# EAGLE design Adapter - Stacking 2 wire [CRY8EI] (EAGLE 9.5.2)
LICENSE: CERN OHL v1.2; REV: CRY8EI; TITLE: SenseTemp 2 Wire Adapter; URL: https://github.com/CapableRobot/SenseTemp
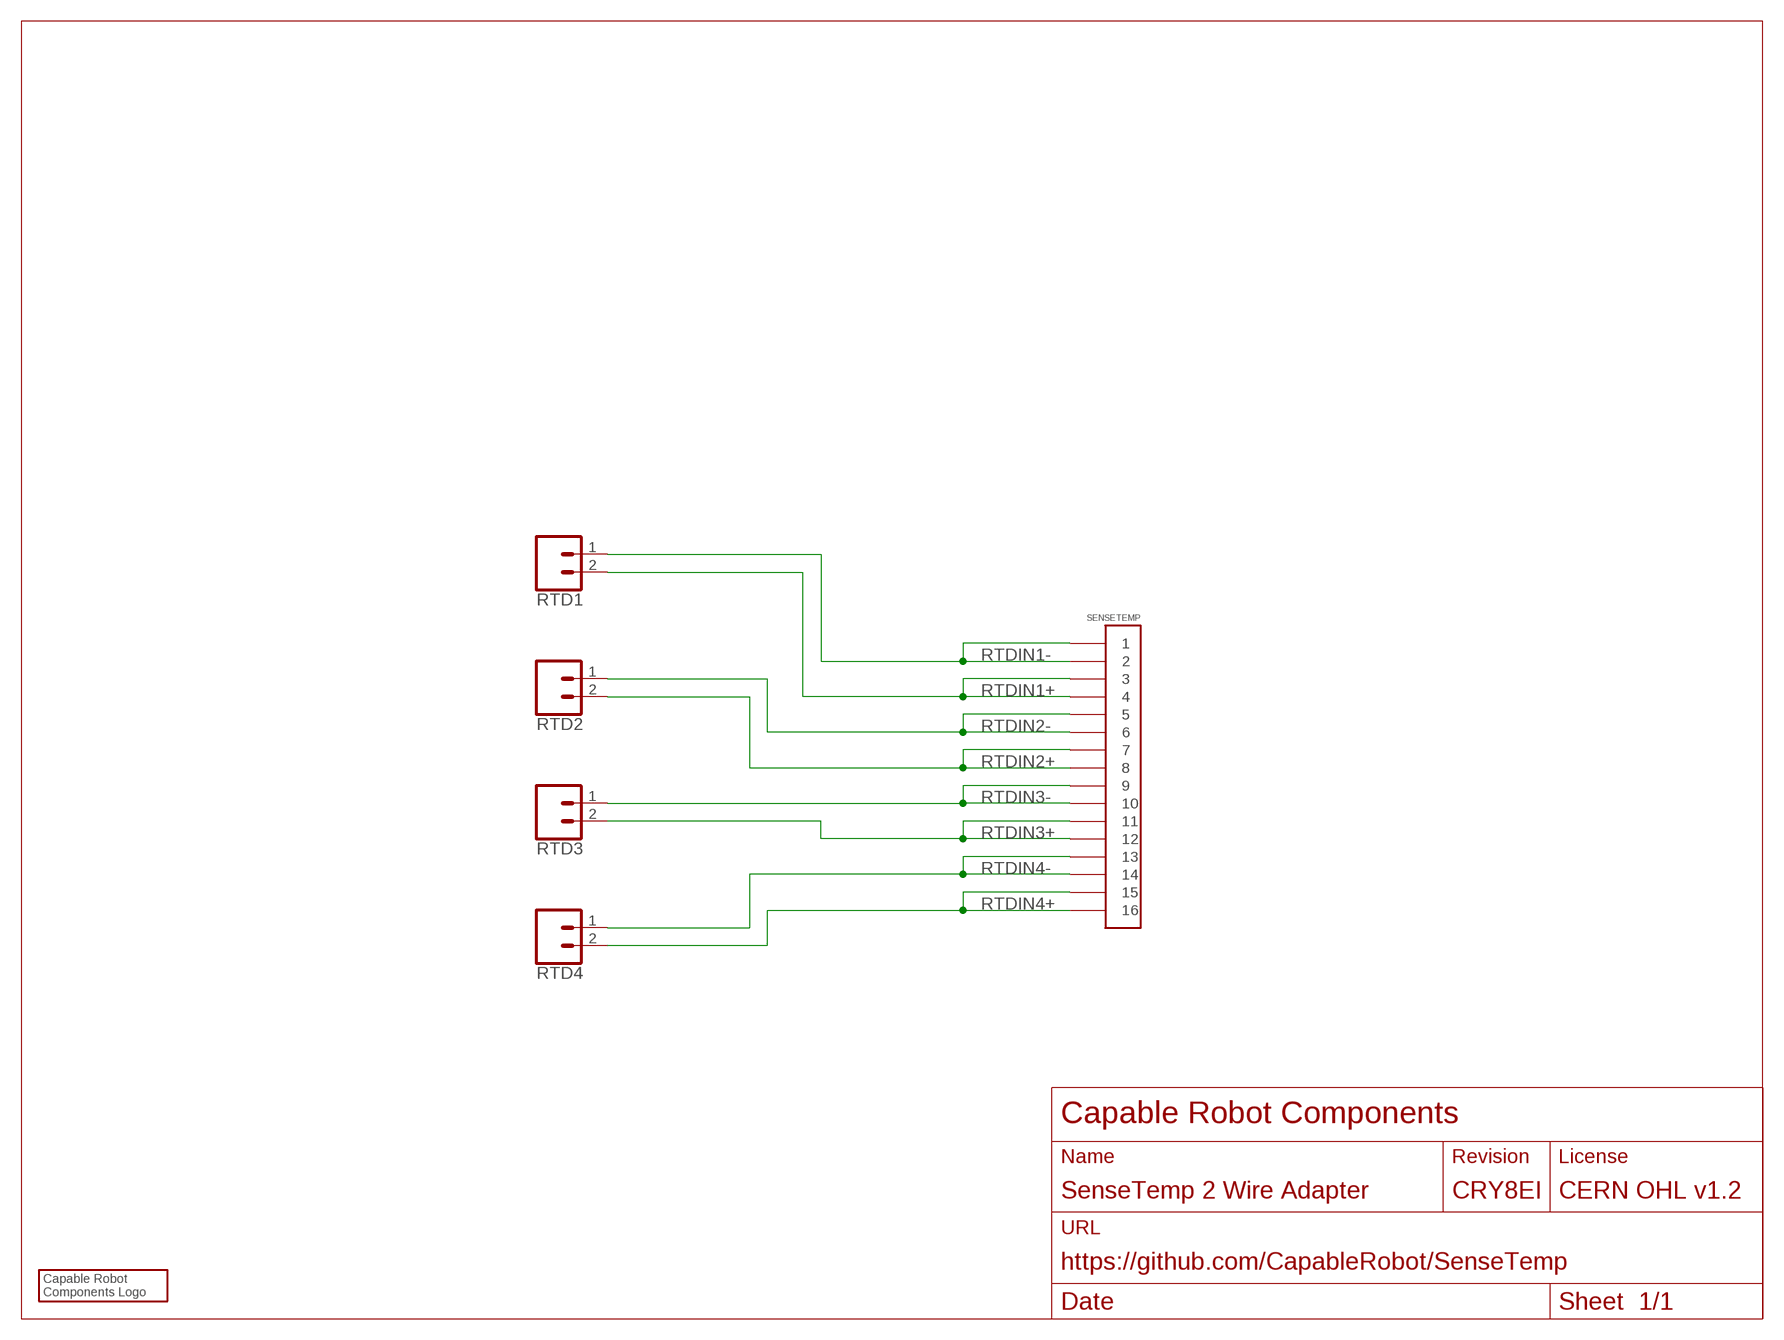
[diagram p0: schematic, sheet 1]

## Parts
LOGO1  CRC-LOGO7SILK  [CRC-LOGO-7-SILK]
RTD1  CONN_025MM  [SCREWTERMINAL-5MM-2]
RTD2  CONN_025MM  [SCREWTERMINAL-5MM-2]
RTD3  CONN_025MM  [SCREWTERMINAL-5MM-2]
RTD4  CONN_025MM  [SCREWTERMINAL-5MM-2]
SENSETEMP  CONN-16ZT  [CONN-2X8-050-SMT-ZT]

## Nets
RTDIN1+: RTD1.2 SENSETEMP.3 SENSETEMP.4
RTDIN1-: RTD1.1 SENSETEMP.1 SENSETEMP.2
RTDIN2+: RTD2.2 SENSETEMP.7 SENSETEMP.8
RTDIN2-: RTD2.1 SENSETEMP.5 SENSETEMP.6
RTDIN3+: RTD3.2 SENSETEMP.11 SENSETEMP.12
RTDIN3-: RTD3.1 SENSETEMP.9 SENSETEMP.10
RTDIN4+: RTD4.2 SENSETEMP.15 SENSETEMP.16
RTDIN4-: RTD4.1 SENSETEMP.13 SENSETEMP.14

## Library data of the parts
LOGO1 = CapableRobot:CRC-LOGO
RTD1-RTD4 = SparkFun-Connectors:CONN_02: Multi connection point. Often used as Generic Header-pin footprint for 0.1 inch spaced/style header connections On any of the 0.1 inch spaced packages, you can populate with these: Break Away Headers - Straight <https://www.sparkfun.com/products/116> (PRT-00116) Break Away Male Headers - Right Angle <https://www.sparkfun.com/products/553> (PRT-00553) Female Headers <https://www.sparkfun.com/products/115> (PRT-00115) Break Away Headers - Machine Pin <https://www.sparkfun.com/products/117> (PRT-00117) Break Away Female Headers - Swiss Machine Pin <https://www.sparkfun.com/products/743> (PRT-00743) For SCREWTERMINALS and SPRING TERMINALS visit here: Screw Terimnals on SparkFun.com <https://www.sparkfun.com/search/results?term=Screw+Terminals> (5mm/3.5mm/2.54mm spacing) This device is also useful as a general connection point to wire up your design to another part of your project. Our various solder wires solder well into these plated through hole pads. Hook-Up Wire - Assortment (Stranded, 22 AWG) <https://www.sparkfun.com/products/11375> (PRT-11375) Hook-Up Wire - Assortment (Solid Core, 22 AWG) <https://www.sparkfun.com/products/11367> (PRT-11367) View the entire wire category on our website here <https://www.sparkfun.com/categories/141> Special notes: Molex polarized connector foot print use with: PRT-08233 with associated crimp pins and housings. 2.54_SCREWTERM for use with PRT-10571. 3.5mm Screw Terminal footprints for PRT-08084 5mm Screw Terminal footprints for use with PRT-08432; SF_SKU: PRT-08432
SENSETEMP = CapableRobot:CONN-16; MPN: 3221-16-0300-00

## Board
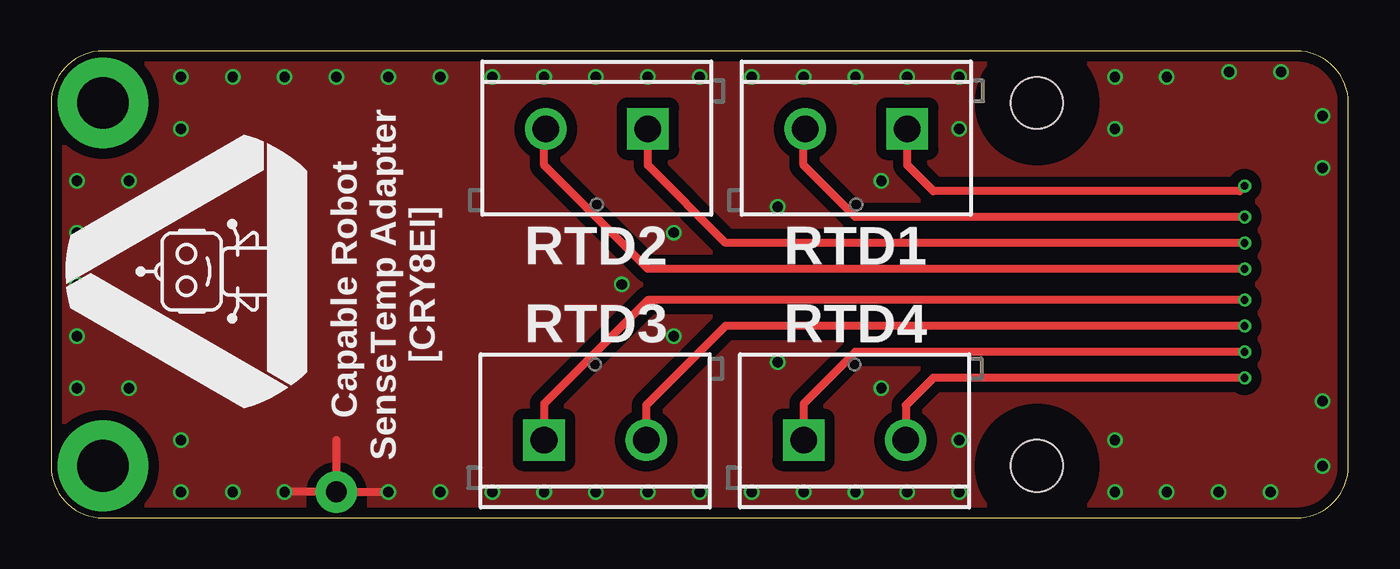
[diagram p1: board, top side]
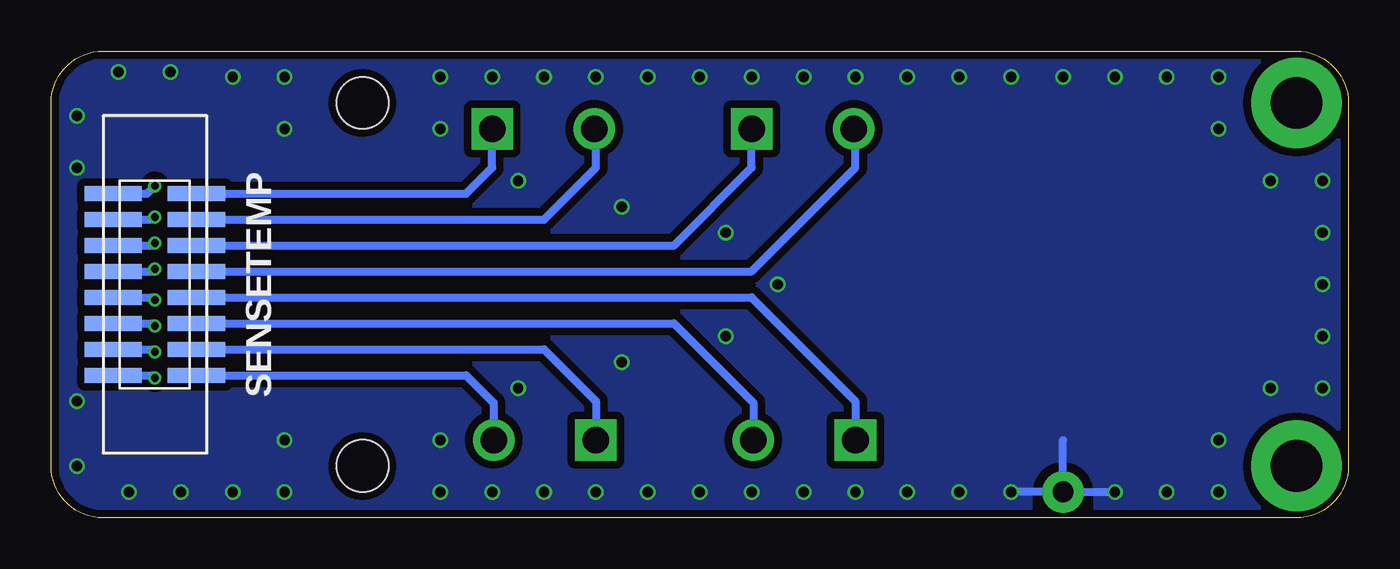
[diagram p2: board, bottom side, seen from below]

Size 63.5 x 22.86 mm. Coordinates in mm from the lower left corner, seen from the top.
Outline: 0,20.32 0,2.54 arc90 2.54,0 60.96,0 arc90 63.5,2.54 63.5,20.32 arc90 60.96,22.86 2.54,22.86 arc90 0,20.32
Copper layers (1*16): Top 0.035559375mm / dielectric 1.6mm / Bottom 0.035559375mm
Design rules "oshpark-2layer-tented *": minimum track width 6mil, minimum drill 10mil, track to track 6mil, track to pad 6mil, pad to pad 6mil, via to via 6mil, smd to smd 6mil, copper to edge 15mil, drill to drill 6mil, minimum pad ring 5mil, minimum via ring 5mil, stop-mask expansion 2.5mil, vias tented up to drill 25mil, thermal gap 10mil
Holes 2.54 mm at 48.26,2.54 48.26,20.32
tRestrict: area 45.7,17.8 to 50.8,22.9; area 45.7,0 to 50.8,5.1

### Footprints (pad centres in the part's own frame; a part is rotated, then mirrored left to right if it is on the bottom)
SCREWTERMINAL-5MM-2 = drill 1.3 pad 2.032 square: 1 0,0 | drill 1.3 pad 2.032: 2 5,0
CONN-2X8-050-SMT-ZT = smd 0.737 x 2.794: 1 4.445,2.032; 2 4.445,-2.032; 3 3.175,2.032; 4 3.175,-2.032; 5 1.905,2.032; 6 1.905,-2.032; 7 0.635,2.032; 8 0.635,-2.032; 9 -0.635,2.032; 10 -0.635,-2.032; 11 -1.905,2.032; 12 -1.905,-2.032; 13 -3.175,2.032; 14 -3.175,-2.032; 15 -4.445,2.032; 16 -4.445,-2.032

### Placement (x,y rotation side)
LOGO1  7.63,12.07 90 top
RTD1  41.91,19.05 180 top
RTD2  29.21,19.05 180 top
RTD3  24.13,3.81 0 top
RTD4  36.83,3.81 0 top
SENSETEMP  58.42,11.43 90 bottom

### Tracks (layer width: path | path; a pad name or v marks a point on that pad's centre or on a via)
GND  (via drill 0.51, 1.02 pad 2.03)
  Top 0.381: v13.97,1.27 v16.51,1.27 | v13.97,1.27 v11.43,1.27 | v13.97,1.27 13.97,3.81
  Bottom 0.381: v13.97,1.27 v11.43,1.27 | v13.97,1.27 13.97,3.81 | v13.97,1.27 v16.51,1.27
  other vias: 57.66,21.84 62.23,5.71 52.07,1.27 52.07,21.59 54.61,21.59 52.07,19.05 57.15,1.27 59.69,1.27 62.23,2.54 62.23,19.68 62.23,17.14 60.2,21.84 54.61,1.27 52.07,3.81 44.45,3.81 44.45,1.27 41.91,1.27 39.37,1.27 36.83,1.27 34.29,1.27 31.75,1.27 29.21,1.27 26.67,1.27 24.13,1.27 21.59,1.27 19.05,1.27 8.89,1.27 6.35,1.27 1.27,6.35 1.27,8.89 1.27,11.43 1.27,13.97 1.27,16.51 3.81,6.35 6.35,3.81 44.45,19.05 44.45,21.59 41.91,21.59 39.37,21.59 36.83,21.59 34.29,21.59 31.75,21.59 29.21,21.59 26.67,21.59 24.13,21.59 21.59,21.59 19.05,21.59 16.51,21.59 13.97,21.59 11.43,21.59 8.89,21.59 6.35,21.59 6.35,19.05 3.81,16.51 30.48,13.97 35.56,15.24 40.64,16.51 40.64,6.35 30.48,8.89 35.56,7.62 27.94,11.43
  pour Bottom (isolate 0.381, rank 6): 0,0 63.5,0 63.5,25.4 0,25.4
  pour Top (isolate 0.508, rank 6): 0,22.86 0,0 12.7,0 48,0.14 48.19,0 63.5,0 63.5,22.86
N$1  (via drill 2.54 pad 4.45)
  other vias: 2.54,2.54
N$2  (via drill 2.54 pad 4.45)
  other vias: 2.54,20.32
OUT
  cutout Top: 12.7,0 12.7,1.27 arc-90 13.97,2.54 arc-90 15.24,1.27 15.24,0
  cutout Bottom: 15.24,0 15.24,1.27 arc90 13.97,2.54 arc90 12.7,1.27 12.7,0
RTDIN1+  (via drill 0.38)
  Top 0.381: v58.42,14.73 39.37,14.73 36.83,17.27 36.83,18.97 RTD1.2
  Bottom 0.381: SENSETEMP.4 39.37,14.61 36.83,17.14 36.83,18.97 RTD1.2 | SENSETEMP.3 58.55,14.61 v58.42,14.73
RTDIN1-  (via drill 0.38)
  Top 0.381: v58.42,16.26 58.17,16 43.18,16 41.91,17.27 RTD1.1
  Bottom 0.381: SENSETEMP.2 43.18,15.88 41.91,17.14 RTD1.1 | SENSETEMP.1 58.8,15.88 v58.42,16.26
RTDIN2+  (via drill 0.38)
  Top 0.381: v58.42,12.19 29.21,12.19 24.13,17.27 24.13,18.97 RTD2.2
  Bottom 0.381: SENSETEMP.8 29.21,12.06 24.13,17.14 24.13,18.97 RTD2.2 | SENSETEMP.7 58.55,12.06 v58.42,12.19
RTDIN2-  (via drill 0.38)
  Top 0.381: v58.42,13.46 33.02,13.46 29.21,17.27 RTD2.1
  Bottom 0.381: SENSETEMP.6 33.02,13.34 29.21,17.14 RTD2.1 | SENSETEMP.5 58.55,13.34 v58.42,13.46
RTDIN3+  (via drill 0.38)
  Top 0.381: v58.42,9.4 33.02,9.4 29.13,5.51 RTD3.2
  Bottom 0.381: SENSETEMP.12 33.02,9.53 29.13,5.63 RTD3.2 | SENSETEMP.11 58.55,9.53 v58.42,9.4
RTDIN3-  (via drill 0.38)
  Top 0.381: v58.42,10.67 29.21,10.67 24.13,5.59 RTD3.1
  Bottom 0.381: SENSETEMP.10 29.21,10.79 24.13,5.71 RTD3.1 | SENSETEMP.9 58.55,10.79 v58.42,10.67
RTDIN4+  (via drill 0.38)
  Top 0.381: v58.42,6.86 43.18,6.86 41.83,5.51 RTD4.2
  Bottom 0.381: SENSETEMP.16 43.18,6.99 41.83,5.63 RTD4.2 | SENSETEMP.15 58.55,6.99 v58.42,6.86
RTDIN4-  (via drill 0.38)
  Top 0.381: v58.42,8.13 39.37,8.13 36.83,5.59 RTD4.1
  Bottom 0.381: SENSETEMP.14 39.37,8.26 36.83,5.71 RTD4.1 | SENSETEMP.13 58.55,8.26 v58.42,8.13

### Text on the board
tPlace: Capable Robot / SenseTemp Adapter / [CRY8EI]